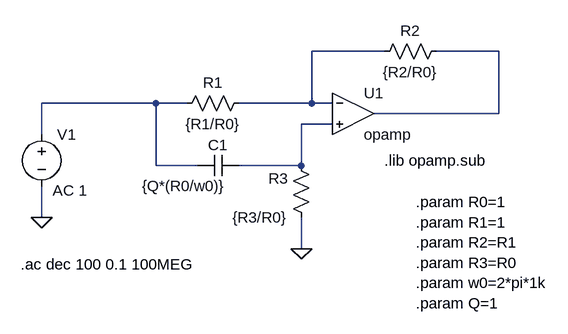
[diagram p0: schematic TS1.asc]
TS1.asc, the LTspice schematic file:
Version 4
SHEET 1 880 680
WIRE 208 64 96 64
WIRE 384 64 288 64
WIRE -144 144 -320 144
WIRE -96 144 -144 144
WIRE 96 144 96 64
WIRE 96 144 -16 144
WIRE 128 144 96 144
WIRE 384 160 384 64
WIRE 384 160 192 160
WIRE 128 176 80 176
WIRE -320 192 -320 144
WIRE -144 240 -144 144
WIRE -80 240 -144 240
WIRE 80 240 80 176
WIRE 80 240 -16 240
WIRE -320 320 -320 272
WIRE 80 368 80 320
FLAG 80 368 0
FLAG -320 320 0
SYMBOL OpAmps\\opamp 160 96 R0
SYMATTR InstName U1
SYMBOL res 0 128 R90
WINDOW 0 0 56 VBottom 2
WINDOW 3 32 56 VTop 2
SYMATTR InstName R1
SYMATTR Value {R1/R0}
SYMBOL res 304 48 R90
WINDOW 0 0 56 VBottom 2
WINDOW 3 32 56 VTop 2
SYMATTR InstName R2
SYMATTR Value {R2/R0}
SYMBOL res 96 336 R180
WINDOW 0 36 76 Left 2
WINDOW 3 37 16 Left 2
SYMATTR InstName R3
SYMATTR Value {R3/R0}
SYMBOL cap -16 224 R90
WINDOW 0 0 32 VBottom 2
WINDOW 3 32 85 VTop 2
SYMATTR InstName C1
SYMATTR Value {Q*(R0/w0)}
SYMBOL voltage -320 176 R0
WINDOW 123 17 102 Left 2
WINDOW 39 0 0 Left 0
SYMATTR Value2 AC 1
SYMATTR InstName V1
SYMATTR Value ""
TEXT -352 392 Left 2 !.ac dec 100 0.1 100MEG
TEXT 208 232 Left 2 !.lib opamp.sub
TEXT 256 296 Left 2 !.param R0=1\n.param R1=1\n.param R2=R1\n.param R3=R0\n.param w0=2*pi*1k\n.param Q=1

The netlist it stands for:
* TS1.asc
XU1 N001 N004 N002 opamp Aol=100K GBW=10Meg  ; pins invin noninvin out
R1 N001 N003 {R1/R0}
R2 N002 N001 {R2/R0}
R3 0 N004 {R3/R0}
C1 N004 N003 {Q*(R0/w0)}
V1 N003 0 AC 1
.ac dec 100 0.1 100MEG
.lib opamp.sub
.param R0=1
.param R1=1
.param R2=R1
.param R3=R0
.param w0=2*pi*1k
.param Q=1
.backanno
.end